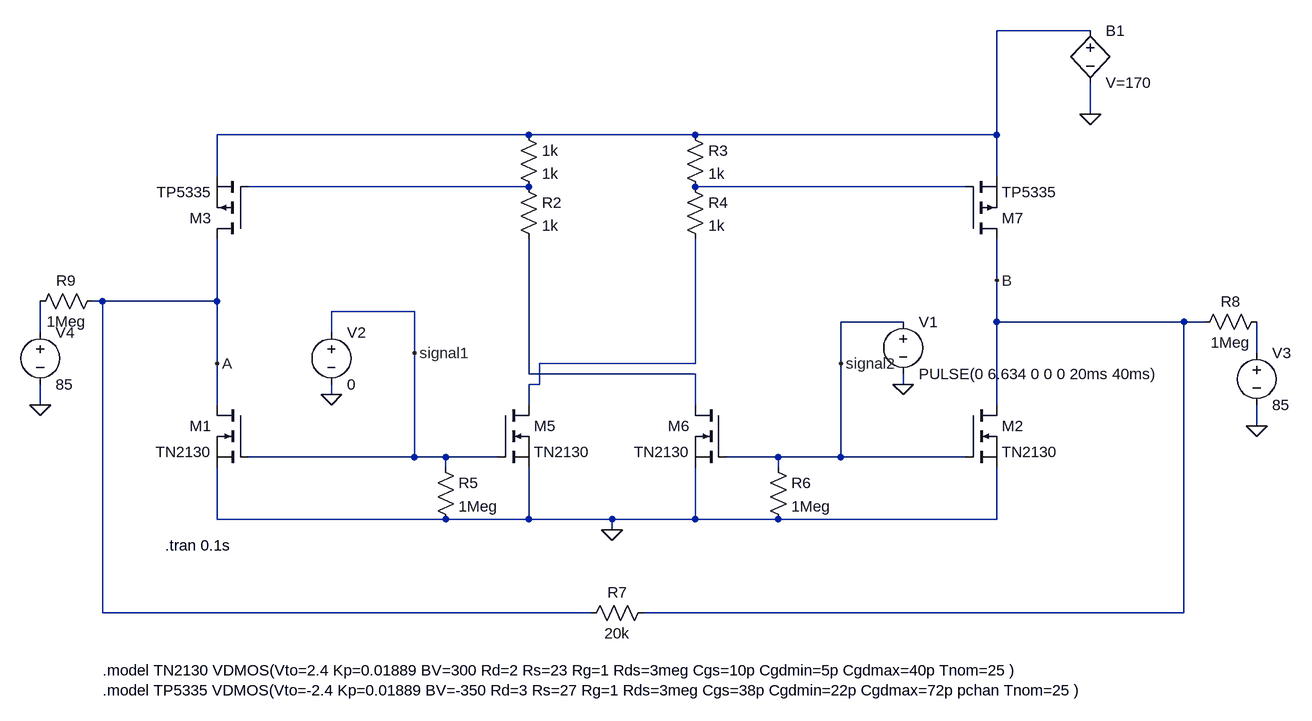
[diagram p0: schematic OutputDriver.asc]
OutputDriver.asc, the LTspice schematic file:
Version 4
SHEET 1 2032 724
WIRE 1168 -304 1024 -304
WIRE 1168 -176 1168 -224
WIRE 304 -144 -176 -144
WIRE 560 -144 304 -144
WIRE 1024 -144 1024 -304
WIRE 1024 -144 560 -144
WIRE -176 -80 -176 -144
WIRE 1024 -80 1024 -144
WIRE 304 -64 -128 -64
WIRE 976 -64 560 -64
WIRE 1024 80 1024 16
WIRE -352 112 -368 112
WIRE -176 112 -176 16
WIRE -176 112 -352 112
WIRE 128 128 0 128
WIRE 880 144 784 144
WIRE 1024 144 1024 80
WIRE 1312 144 1024 144
WIRE 1344 144 1312 144
WIRE -448 160 -448 112
WIRE 0 160 0 128
WIRE 128 192 128 128
WIRE 1424 192 1424 144
WIRE -176 208 -176 112
WIRE 560 208 560 16
WIRE 560 208 320 208
WIRE 784 208 784 144
WIRE 304 224 304 16
WIRE 560 224 304 224
WIRE 320 240 320 208
WIRE 320 240 304 240
WIRE 880 240 880 224
WIRE 0 256 0 240
WIRE -448 272 -448 240
WIRE -176 272 -176 208
WIRE 304 272 304 240
WIRE 560 272 560 224
WIRE 1024 272 1024 144
WIRE 1424 304 1424 272
WIRE 128 352 128 192
WIRE 128 352 -128 352
WIRE 176 352 128 352
WIRE 256 352 176 352
WIRE 688 352 608 352
WIRE 784 352 784 208
WIRE 784 352 688 352
WIRE 976 352 784 352
WIRE 176 368 176 352
WIRE 688 368 688 352
WIRE -176 448 -176 368
WIRE 176 448 -176 448
WIRE 304 448 304 368
WIRE 304 448 176 448
WIRE 432 448 304 448
WIRE 560 448 560 368
WIRE 560 448 432 448
WIRE 688 448 560 448
WIRE 1024 448 1024 368
WIRE 1024 448 688 448
WIRE 432 464 432 448
WIRE -352 592 -352 112
WIRE 400 592 -352 592
WIRE 1312 592 1312 144
WIRE 1312 592 480 592
FLAG 432 464 0
FLAG 1168 -176 0
FLAG 0 256 0
FLAG 880 240 0
FLAG -176 208 A
FLAG 1024 80 B
FLAG -448 272 0
FLAG 1424 304 0
FLAG 128 192 signal1
FLAG 784 208 signal2
SYMBOL res 288 -160 R0
SYMATTR InstName 1k
SYMATTR Value 1k
SYMBOL res 288 -80 R0
SYMATTR InstName R2
SYMATTR Value 1k
SYMBOL res 544 -160 R0
SYMATTR InstName R3
SYMATTR Value 1k
SYMBOL res 544 -80 R0
SYMATTR InstName R4
SYMATTR Value 1k
SYMBOL res 160 352 R0
SYMATTR InstName R5
SYMATTR Value 1Meg
SYMBOL res 672 352 R0
SYMATTR InstName R6
SYMATTR Value 1Meg
SYMBOL nmos -128 272 M0
SYMATTR InstName M1
SYMATTR Value TN2130
SYMBOL nmos 976 272 R0
SYMATTR InstName M2
SYMATTR Value TN2130
SYMBOL pmos -128 16 R180
SYMATTR InstName M3
SYMATTR Value TP5335
SYMBOL bv 1168 -320 R0
SYMATTR InstName B1
SYMATTR Value V=170
SYMBOL nmos 256 272 R0
SYMATTR InstName M5
SYMATTR Value TN2130
SYMBOL nmos 608 272 M0
SYMATTR InstName M6
SYMATTR Value TN2130
SYMBOL voltage 880 128 R0
WINDOW 123 0 0 Left 0
WINDOW 39 0 0 Left 0
SYMATTR InstName V1
SYMATTR Value PULSE(0 6.634 0 0 0 20ms 40ms)
SYMBOL voltage 0 144 R0
WINDOW 123 0 0 Left 0
WINDOW 39 0 0 Left 0
SYMATTR InstName V2
SYMATTR Value 0
SYMBOL pmos 976 16 M180
SYMATTR InstName M7
SYMATTR Value TP5335
SYMBOL res 1440 128 R90
WINDOW 0 0 56 VBottom 2
WINDOW 3 32 56 VTop 2
SYMATTR InstName R8
SYMATTR Value 1Meg
SYMBOL res -352 96 R90
WINDOW 0 0 56 VBottom 2
WINDOW 3 32 56 VTop 2
SYMATTR InstName R9
SYMATTR Value 1Meg
SYMBOL res 496 576 R90
WINDOW 0 0 56 VBottom 2
WINDOW 3 32 56 VTop 2
SYMATTR InstName R7
SYMATTR Value 20k
SYMBOL voltage 1424 176 R0
WINDOW 123 0 0 Left 0
WINDOW 39 0 0 Left 0
SYMATTR InstName V3
SYMATTR Value 85
SYMBOL voltage -448 144 R0
WINDOW 123 0 0 Left 0
WINDOW 39 0 0 Left 0
SYMATTR InstName V4
SYMATTR Value 85
TEXT -256 488 Left 2 !.tran 0.1s
TEXT -352 680 Left 2 !.model TN2130 VDMOS(Vto=2.4 Kp=0.01889 BV=300 Rd=2 Rs=23 Rg=1 Rds=3meg Cgs=10p Cgdmin=5p Cgdmax=40p Tnom=25 )\n.model TP5335 VDMOS(Vto=-2.4 Kp=0.01889 BV=-350 Rd=3 Rs=27 Rg=1 Rds=3meg Cgs=38p Cgdmin=22p Cgdmax=72p pchan Tnom=25 )

The netlist it stands for:
* OutputDriver.asc
R§1k N001 N002 1k
R2 N002 N007 1k
R3 N001 N003 1k
R4 N003 N006 1k
R5 signal1 0 1Meg
R6 signal2 0 1Meg
M1 A signal1 0 0 TN2130
M2 B signal2 0 0 TN2130
M3 A N002 N001 N001 TP5335
B1 N001 0 V=170
M5 N006 signal1 0 0 TN2130
M6 N007 signal2 0 0 TN2130
V1 signal2 0 PULSE(0 6.634 0 0 0 20ms 40ms)
V2 signal1 0 0
M7 B N003 N001 N001 TP5335
R8 N005 B 1Meg
R9 A N004 1Meg
R7 B A 20k
V3 N005 0 85
V4 N004 0 85
.model NMOS NMOS
.model PMOS PMOS
.lib standard.mos
.tran 0.1s
.model TN2130 VDMOS(Vto=2.4 Kp=0.01889 BV=300 Rd=2 Rs=23 Rg=1 Rds=3meg Cgs=10p Cgdmin=5p Cgdmax=40p Tnom=25 )
.model TP5335 VDMOS(Vto=-2.4 Kp=0.01889 BV=-350 Rd=3 Rs=27 Rg=1 Rds=3meg Cgs=38p Cgdmin=22p Cgdmax=72p pchan Tnom=25 )
.backanno
.end